# EAGLE design BT9803-150616-V2.0 (EAGLE 6.4)
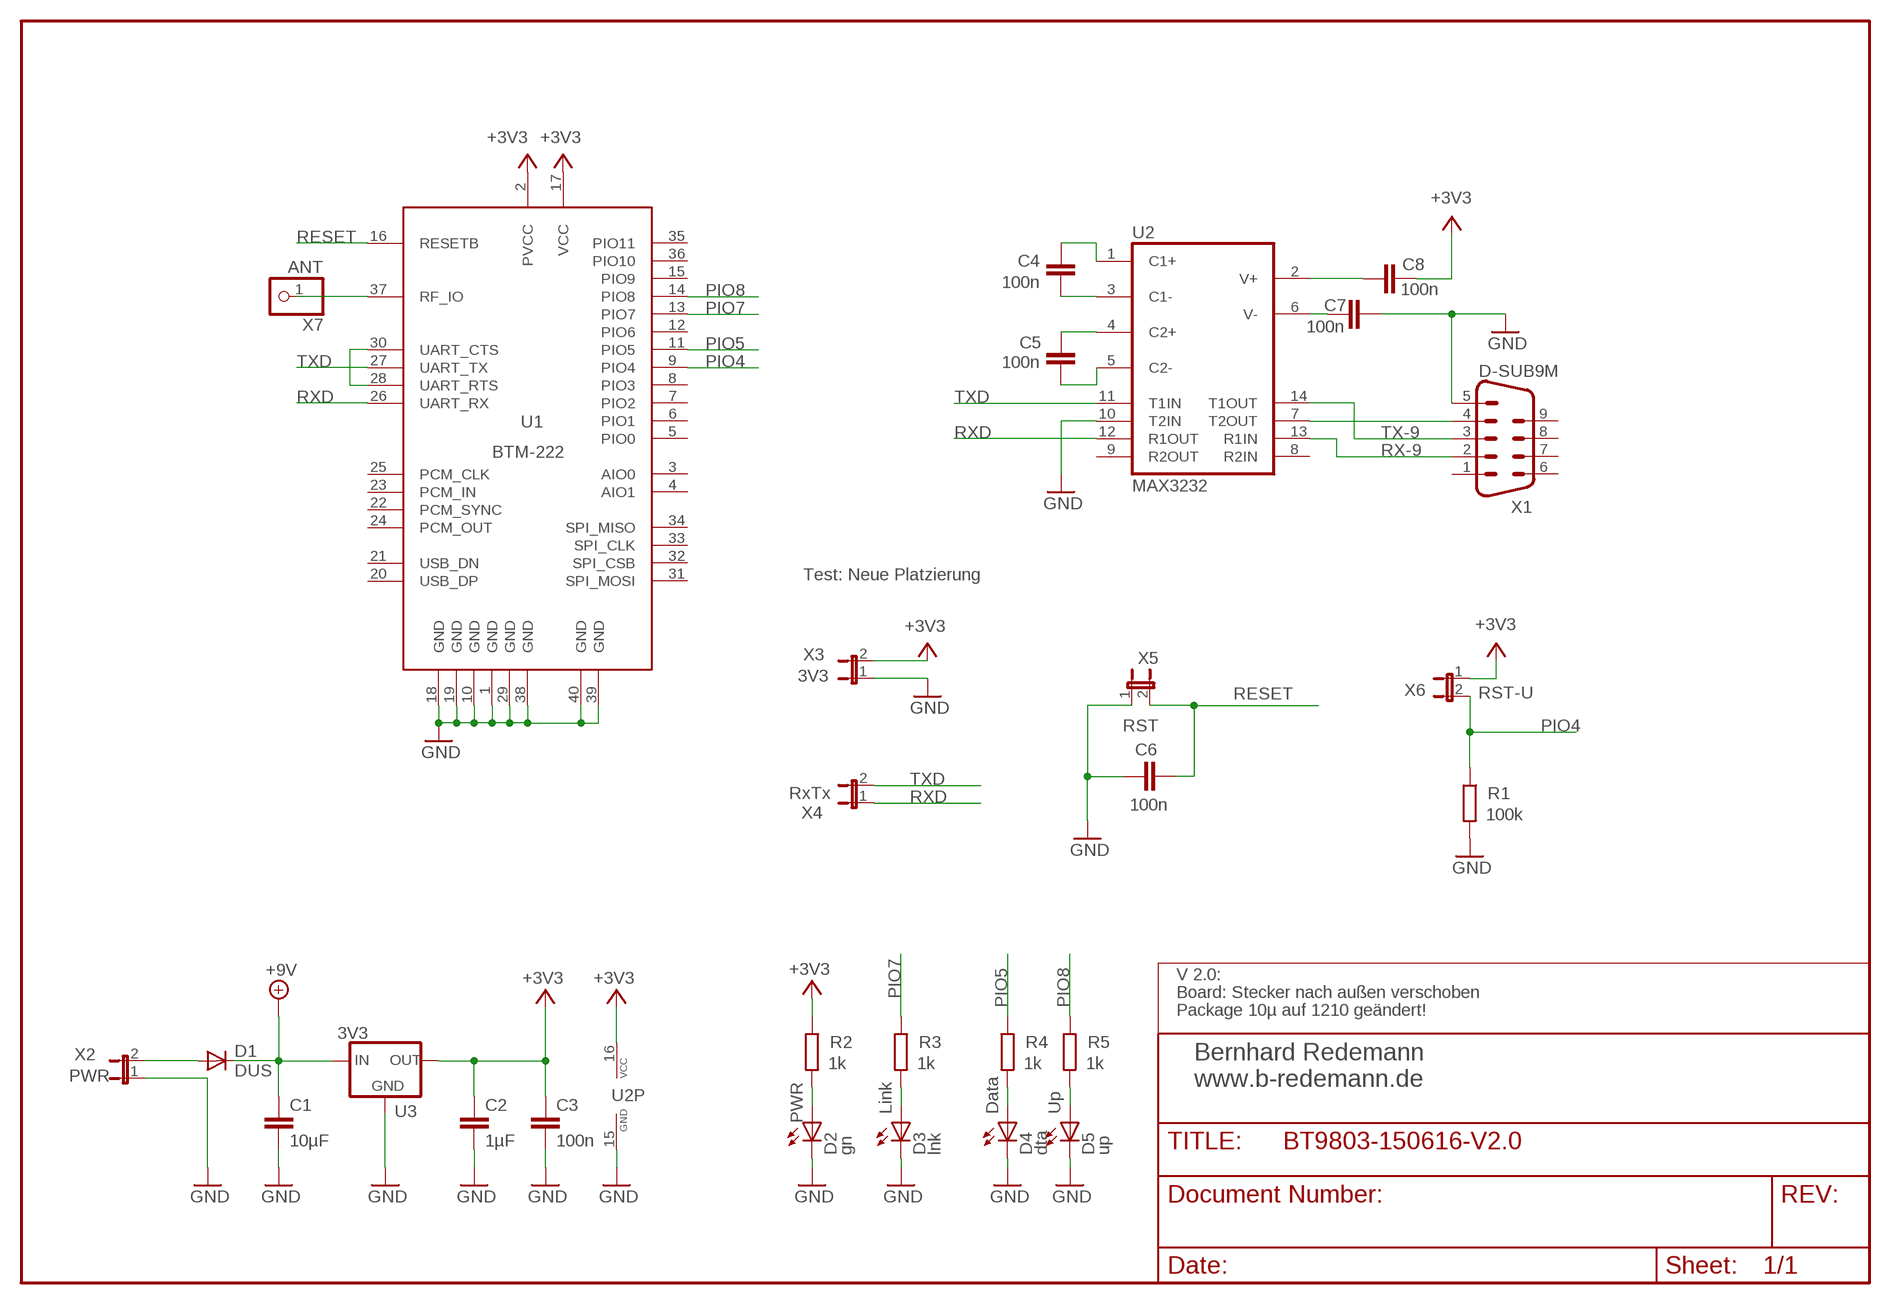
[diagram p0: schematic, sheet 1]

## Parts
C1  10µF  C-EUC1210  [C1210]
C2  1µF  C-EUC0805  [C0805]
C3  100n  C-EUC0805  [C0805]
C4  100n  C-EUC0805  [C0805]
C5  100n  C-EUC0805  [C0805]
C6  100n  C-EUC0805  [C0805]
C7  100n  C-EUC0805  [C0805]
C8  100n  C-EUC0805  [C0805]
D1  DUS  DIODE-DO-214AC  [DO-214AC]
D2  gn  LEDCHIP-LED0805  [CHIP-LED0805]
D3  lnk  LED3MM  [LED3MM]
D4  dta  LED3MM  [LED3MM]
D5  up  LED3MM  [LED3MM]
R1  100k  R-EU_R0805  [R0805]
R2  1k  R-EU_R0805  [R0805]
R3  1k  R-EU_R0805  [R0805]
R4  1k  R-EU_R0805  [R0805]
R5  1k  R-EU_R0805  [R0805]
U1  BTM-222  [38-PIN15]
U2  MAX3232  MAX232ECWETSSOP16  [TSSOP16]
U3  3V3  LM1117  [SOT223]
X1  D-SUB9M  M09D  [M09D]
X2  PWR  JP1E  [JP1]
X3  3V3  JP1E  [JP1]
X4  RxTx  JP1E  [JP1]
X5  RST  JP1E  [JP1]
X6  RST-U  JP1E  [JP1]
X7  ANT  PINHD-1X1  [1X01]

## Nets
+3V3: C2.1 C3.1 C8.1 R2.1 U1.2(PVCC) U1.17(VCC) U2.16(VCC) U3.2(OUT) X3.2 X6.1
+9V: C1.1 D1.C U3.3(IN)
DATA: D4.A R4.2
GND: C1.2 C2.2 C3.2 C6.1 C7.1 D2.C D3.K(C) D4.K(C) D5.K(C) R1.2 U1.1(GND) U1.10(GND) U1.18(GND) U1.19(GND) U1.29(GND) U1.38(GND) U1.39(GND) U1.40(GND) U2.10(T2IN) U2.15(GND) U3.1(GND) X1.5 X2.1 X3.1 X5.1
LINK: D3.A R3.2
N$1: U2.7(T2OUT) X1.4
N$2: U1.28(UART_RTS) U1.30(UART_CTS)
N$3: D1.A X2.2
N$351: C4.1 U2.3(C1-)
N$354: C5.2 U2.4(C2+)
N$355: C4.2 U2.1(C1+)
N$356: C5.1 U2.5(C2-)
N$357: C7.2 U2.6(V-)
N$358: C8.2 U2.2(V+)
PIO4: R1.1 U1.9(PIO4) X6.2
PIO5: R4.1 U1.11(PIO5)
PIO7: R3.1 U1.13(PIO7)
PIO8: R5.1 U1.14(PIO8)
PWR: D2.A R2.2
RESET: C6.2 U1.16(RESETB) X5.2
RF-222: U1.37(RF_IO) X7.1
RX-9: U2.13(R1IN) X1.2
RXD: U1.26(UART_RX) U2.12(R1OUT) X4.1
TX-9: U2.14(T1OUT) X1.3
TXD: U1.27(UART_TX) U2.11(T1IN) X4.2
UP: D5.A R5.2
Unconnected: U1.3(AIO0) U1.4(AIO1) U1.5(PIO0) U1.6(PIO1) U1.7(PIO2) U1.8(PIO3) U1.12(PIO6) U1.15(PIO9) U1.20(USB_DP) U1.21(USB_DN) U1.22(PCM_SYNC) U1.23(PCM_IN) U1.24(PCM_OUT) U1.25(PCM_CLK) U1.31(SPI_MOSI) U1.32(SPI_CSB) U1.33(SPI_CLK) U1.34(SPI_MISO) U1.35(PIO11) U1.36(PIO10) U2.8(R2IN) U2.9(R2OUT) X1.1 X1.6 X1.7 X1.8 X1.9

## Notes on the sheet
- Test: Neue Platzierung
- V 2.0:
- Board: Stecker nach außen verschoben
- Package 10µ auf 1210 geändert!
- Bernhard Redemann
  www.b-redemann.de
- Link | Data | Up
- PWR

## Library data of the parts
C1-C8 = rcl:C-EU: CAPACITOR, European symbol
D1 = diode:DIODE-: DIODE
D2-D5 = led:LED: LED OSRAM: - CHIPLED LG R971, LG N971, LY N971, LG Q971, LY Q971, LO R971, LY R971 LH N974, LH R974 LS Q976, LO Q976, LY Q976 LO Q996 - Hyper CHIPLED LW Q18S LB Q993, LB Q99A, LB R99A - SideLED LS A670, LO A670, LY A670, LG A670, LP A670 LB A673, LV A673, LT A673, LW A673 LH A674 LY A675 LS A676, LA A676, LO A676, LY A676, LW A676 LS A679, LY A679, LG A679 - Hyper Micro SIDELED® LS Y876, LA Y876, LO Y876, LY Y876 LT Y87S - SmartLED LW L88C, LW L88S LB L89C, LB L89S, LG L890 LS L89K, LO L89K, LY L89K LS L896, LA L896, LO L896, LY L896 - TOPLED LS T670, LO T670, LY T670, LG T670, LP T670 LSG T670, LSP T670, LSY T670, LOP T670, LYG T670 LG T671, LOG T671, LSG T671 LB T673, LV T673, LT T673, LW T673 LH T674 LS T676, LA T676, LO T676, LY T676, LB T676, LH T676, LSB T676, LW T676 LB T67C, LV T67C, LT T67C, LS T67K, LO T67K, LY T67K, LW E67C LS E67B, LA E67B, LO E67B, LY E67B, LB E67C, LV E67C, LT E67C LW T67C LS T679, LY T679, LG T679 LS T770, LO T770, LY T770, LG T770, LP T770 LB T773, LV T773, LT T773, LW T773 LH T774 LS E675, LA E675, LY E675, LS T675 LS T776, LA T776, LO T776, LY T776, LB T776 LHGB T686 LT T68C, LB T68C - Hyper Mini TOPLED® LB M676 - Mini TOPLED Santana® LG M470 LS M47K, LO M47K, LY M47K Source: http://www.osram.convergy.de LUXEON: - LUMILED® LXK2-PW12-R00, LXK2-PW12-S00, LXK2-PW14-U00, LXK2-PW14-V00 LXK2-PM12-R00, LXK2-PM12-S00, LXK2-PM14-U00 LXK2-PE12-Q00, LXK2-PE12-R00, LXK2-PE12-S00, LXK2-PE14-T00, LXK2-PE14-U00 LXK2-PB12-K00, LXK2-PB12-L00, LXK2-PB12-M00, LXK2-PB14-N00, LXK2-PB14-P00, LXK2-PB14-Q00 LXK2-PR12-L00, LXK2-PR12-M00, LXK2-PR14-Q00, LXK2-PR14-R00 LXK2-PD12-Q00, LXK2-PD12-R00, LXK2-PD12-S00 LXK2-PH12-R00, LXK2-PH12-S00 LXK2-PL12-P00, LXK2-PL12-Q00, LXK2-PL12-R00 Source: www.luxeon.com KINGBRIGHT: KA-3528ASYC Source: www.kingbright.com
R1-R5 = rcl:R-EU_: RESISTOR, European symbol
U1 = BRedemannSpecial:BTM-222
U2 = francotyp:MAX232ECWE: RS232 TRANSEIVER
U3 = v-reg-3:LM1117
X1 = con-subd:M09: SUB-D
X2-X6 = jumper:JP1E: JUMPER
X7 = pinhead:PINHD-1X1: PIN HEADER

## Board
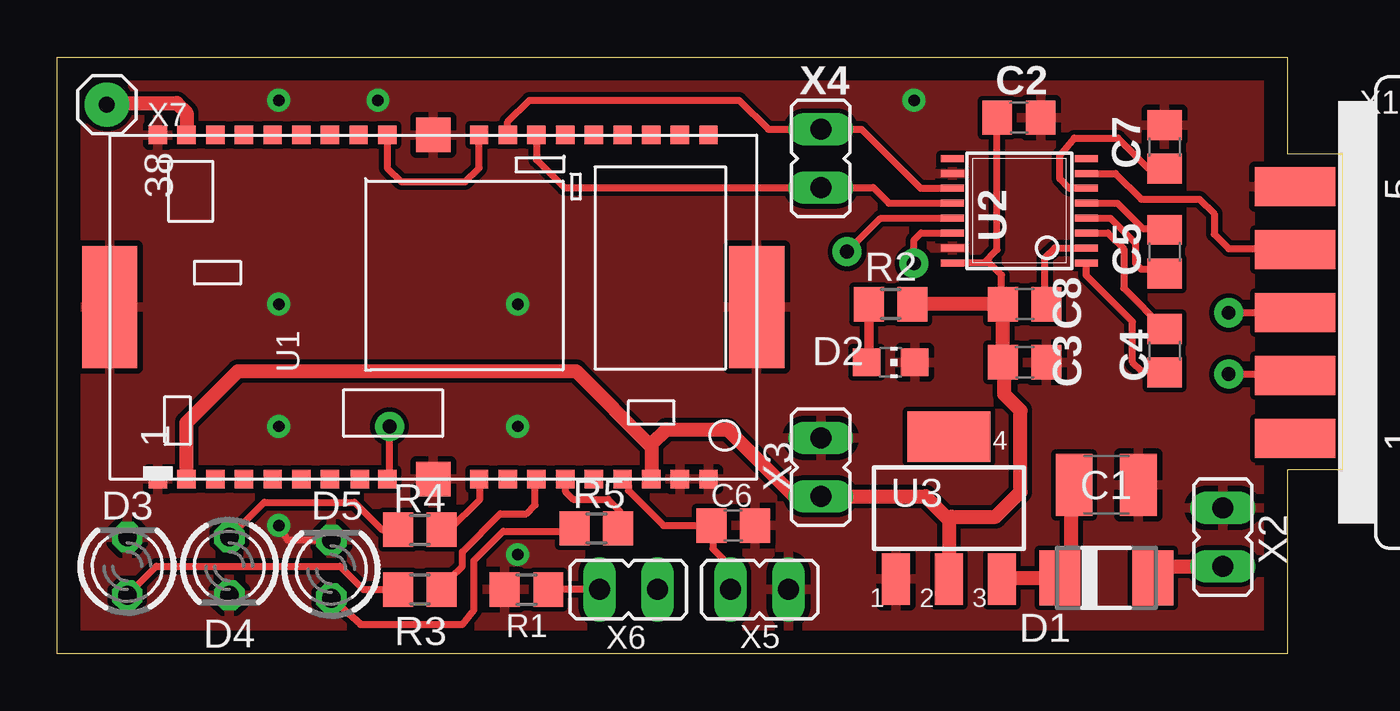
[diagram p1: board, top side]
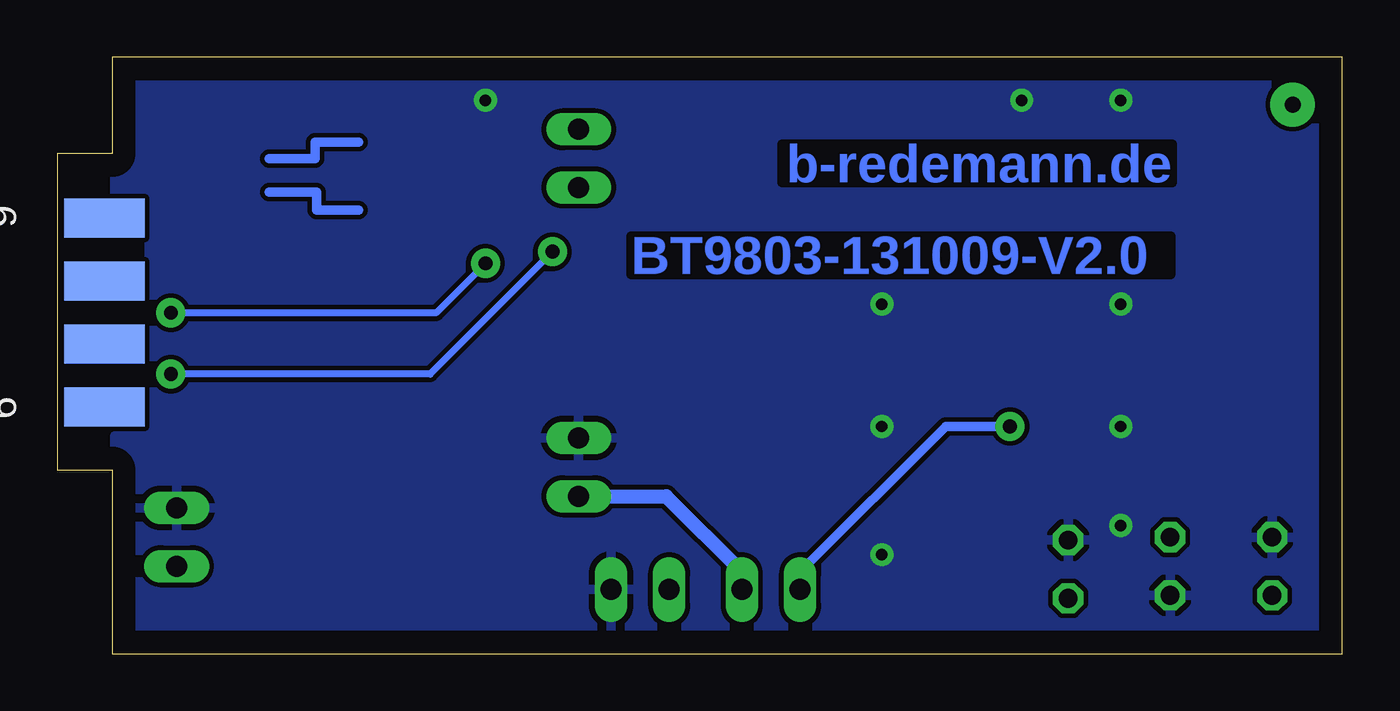
[diagram p2: board, bottom side, seen from below]

Size 56 x 26 mm. Coordinates in mm from the lower left corner, seen from the top.
Outline: 53.6,0 0,0 0,26 53.6,26 53.6,21.8 56,21.8 56,8 53.6,8 53.6,0
Copper layers (1+16): Top 0.035mm / dielectric 1.5mm / Bottom 0.035mm
Design rules "default *": minimum track width 10mil, minimum drill 0.5mm, track to track 8mil, track to pad 6mil, pad to pad 8mil, via to via 8mil, smd to smd 8mil, copper to edge 40mil, drill to drill 8mil, minimum pad ring 10mil, minimum via ring 8mil, stop-mask expansion 4mil, vias tented up to drill 0.61mm, thermal gap 10mil

### Footprints (pad centres in the part's own frame; a part is rotated, then mirrored left to right if it is on the bottom)
C1210 = smd 1.6 x 2.7: 1 -1.4,0; 2 1.4,0
C0805 = smd 1.3 x 1.5: 1 -0.95,0; 2 0.95,0
DO-214AC = smd 1.8 x 2.4: A 2.025,0; C -2.025,0
CHIP-LED0805 = smd 1.2 x 1.2: A 0,-1.05; C 0,1.05
LED3MM = drill 0.813 octagon: A -1.27,0; K 1.27,0
R0805 = smd 1.3 x 1.5: 1 -0.95,0; 2 0.95,0
38-PIN15 = smd 0.8 x 0.8: 1 -7.5,12; 2 -7.5,10.75; 3 -7.5,9.5; 4 -7.5,8.25; 5 -7.5,7; 6 -7.5,5.75; 7 -7.5,4.5; 8 -7.5,3.2; 9 -7.5,2; 11 -7.5,-2; 12 -7.5,-3.25; 13 -7.5,-4.5; 14 -7.5,-5.75; 15 -7.5,-7; 16 -7.5,-8.25; 17 -7.5,-9.5; 18 -7.5,-10.75; 19 -7.5,-12; 20 7.5,-12; 21 7.5,-10.75; 22 7.5,-9.5; 23 7.5,-8.25; 24 7.5,-7; 25 7.5,-5.75; 26 7.5,-4.5; 27 7.5,-3.25; 28 7.5,-2; 30 7.5,2; 31 7.5,3.25; 32 7.5,4.5; 33 7.5,5.75; 34 7.5,7; 35 7.5,8.25; 36 7.5,9.5; 37 7.5,10.75; 38 7.5,12 | smd 1.5 x 1.5: 10 -7.5,0; 29 7.5,0 | smd 5.3 x 2.4: 39 0,14.1; 40 0,-14.1
TSSOP16 = smd 0.305 x 0.991: 1 -2.275,-2.918; 2 -1.625,-2.918; 3 -0.975,-2.918; 4 -0.325,-2.918; 5 0.325,-2.918; 6 0.975,-2.918; 7 1.625,-2.918; 8 2.275,-2.918; 9 2.275,2.918; 10 1.625,2.918; 11 0.975,2.918; 12 0.325,2.918; 13 -0.325,2.918; 14 -0.975,2.918; 15 -1.625,2.918; 16 -2.275,2.918
SOT223 = smd 1.219 x 2.235: 1 -2.311,-3.099; 2 0,-3.099; 3 2.311,-3.099 | smd 3.6 x 2.2: 4 0,3.099
M09D = smd 1.7 x 3.5: 1 5.486,-6.045; 2 2.743,-6.045; 3 0,-6.045; 4 -2.743,-6.045; 5 -5.486,-6.045 | smd 1.7 x 3.5 bottom: 6 4.115,-6.045; 7 1.372,-6.045; 8 -1.372,-6.045; 9 -4.115,-6.045
JP1 = drill 0.914 long: 1 0,-1.27; 2 0,1.27
1X01 = drill 0.7 pad 1.93: 1 0,0

### Placement (x,y rotation side)
C1  45.72,7.37 0 top
C2  41.91,23.37 0 top
C3  42.16,12.7 0 top
C4  48.26,13.21 270 top
C5  48.26,17.53 270 top
C6  29.46,5.59 180 top
C7  48.26,22.1 270 top
C8  42.16,15.24 0 top
D1  45.72,3.3 0 top
D2  36.32,12.7 270 top
D3  3.05,3.81 90 top
D4  7.49,3.81 270 top
D5  11.94,3.68 90 top
R1  20.45,2.79 180 top
R2  36.32,15.24 180 top
R3  15.8,2.8 180 top
R4  15.8,5.4 180 top
R5  23.5,5.46 180 top
U1  16.38,15.11 90 top
U2  41.93,19.32 90 top
U3  38.86,6.35 0 top
X1  60,14.88 270 top
X2  50.8,5.08 180 top
X3  33.27,8.13 180 top
X4  33.27,21.59 0 top
X5  30.61,2.79 90 top
X6  24.89,2.79 90 top
X7  2.16,23.94 0 top

### Tracks (layer width: path | path; a pad name or v marks a point on that pad's centre or on a via)
+3V3
  Top 0.305: 40.39,17.04 40.62,17.04 41.15,16.51 41.15,15.31 C8.1 | 40.39,17.04 U2.16 | C2.1 40.96,17.61 40.39,17.04
  Top 0.406: 25.91,9.02 25.91,9.14 | 25.91,7.64 U1.17 | 41.27,12.7 C3.1 | 38.86,5.84 38.99,5.97
  Top 0.61: U3.2 38.86,5.84 37.85,6.86 X3.2 32.13,6.86 29.21,9.78 26.54,9.78 25.91,9.14 | 25.91,7.64 25.91,9.02 22.61,12.32 7.87,12.32 5.63,10.08 U1.2 | C3.1 C8.1 R2.1 | 41.27,12.7 41.27,11.3 41.98,10.6 41.98,7.05 40.89,5.97 38.99,5.97
  Bottom 0.61: X6.1 26.16,3.56 29.46,6.86 X3.2
+9V
  Top 0.61: C1.1 44.2,7.37 44.2,2.79 43.7,2.79 D1.C 41.17,3.3 U3.3
DATA
  Top 0.305: R4.2 14.16,5.4 12.95,6.6 9.02,6.6 D4.A
GND  (via drill 0.5 pad 1)
  Top 0.305: D5.K 10.03,4.95 v9.65,5.59
  other vias: 20.07,4.32 20.07,9.91 9.65,9.91 9.65,15.24 20.07,15.24 9.65,24.13 13.97,24.13 37.34,24.13
  pour Top: -1,28 53.5,28 53.5,19.5 52,19.5 52,17 52,8 53.5,8 53.5,-2 -1,-2
  pour Bottom: -1,28 53.5,28 53.5,20 52,20 52,9.5 53.5,9.5 53.5,-1 52,-1 -1,-1
LINK
  Top 0.305: R3.2 13.33,2.8 12.32,3.81 4.32,3.81 D3.A
N$1
  Top 0.305: U2.7 46.12,20.94 47.24,19.81 49.78,19.81 50.42,19.18 50.42,18.29 51.05,17.65 53.92,17.65 X1.4
N$2
  Top 0.305: U1.28 18.38,21.18 17.78,20.57 14.99,20.57 14.38,21.18 U1.30
N$3
  Top 0.61: X2.2 47.74,3.81 D1.A
N$300
  Bottom 0.406: 46.76,21.59 44.76,21.59 44.76,22.3 42.87,22.3
N$301
  Bottom 0.406: 46.76,20.12 44.7,20.12 44.7,19.35 42.86,19.35
N$351
  Top 0.305: U2.3 45.8,18.34 46.48,17.65 46.48,15.94 C4.1
N$354
  Top 0.305: U2.4 45.91,18.99 46.99,17.91 46.99,17.02 47.24,16.76 48.07,16.76 C5.2
N$355
  Top 0.305: U2.1 44.85,16.49 46.86,14.48 46.86,12.7 47.24,12.32 48.2,12.32 C4.2
N$356
  Top 0.305: U2.5 46.21,19.64 47.3,18.54 48.39,18.54 C5.1
N$357
  Top 0.305: C7.2 47.56,21.15 46.23,22.48 44.32,22.48 43.69,21.72 43.69,20.7 44.1,20.29 U2.6
N$358
  Top 0.305: U2.2 43.47,17.69 43.05,17.27 43.05,15.3 C8.2
PIO4  (via drill 0.6 pad 1.27)
  Top 0.305: X6.2 R1.1 | v14.48,9.91 14.48,7.71 U1.9
  Top 0.406: U1.9 14.35,7.64
  Bottom 0.406: X6.2 23.62,3.56 17.27,9.91 v14.48,9.91
PIO5
  Top 0.305: R4.1 17.08,5.4 18.41,6.73 18.41,7.58 U1.11
PIO7
  Top 0.305: R3.1 16.75,3.03 17.14,3.03 17.14,3.3 17.65,3.81 17.65,4.45 19.3,6.1 20.45,6.1 20.83,6.48 20.83,7.56 U1.13
PIO8
  Top 0.305: U1.14 22.13,7.08 22.48,6.73 24,6.73 24.51,6.22 24.51,5.53 R5.1
PWR
  Top 0.406: R2.2 35.37,12.8 D2.A
RESET
  Top 0.305: X5.2 29.28,3.88 28.57,4.57 28.57,5.59 C6.2 26.42,5.59 24.89,7.11 24.89,7.35 U1.16
RF-222
  Top 0.406: X7.1 2.22,24
  Top 0.61: U1.37 5.63,23.58 5.21,24 2.22,24
RX-9  (via drill 0.6 pad 1.27)
  Top 0.305: U2.13 35.88,18.99 v34.42,17.53 | v51.05,12.19 53.9,12.19 X1.2
  Bottom 0.305: v34.42,17.53 39.75,12.19 v51.05,12.19
RXD
  Top 0.305: U2.12 36.24,19.64 35.56,20.32 X4.1 22.1,20.32 20.88,21.54 U1.26
TX-9  (via drill 0.6 pad 1.27)
  Top 0.305: X1.3 51.07,14.88 v51.05,14.86 | U2.14 37.64,18.34 37.34,18.03 v37.34,17.02
  Bottom 0.305: v51.05,14.86 39.5,14.86 v37.34,17.02
TXD
  Top 0.305: U1.27 19.63,23.19 20.57,24.13 29.72,24.13 30.99,22.86 X4.2 35.05,22.86 37.62,20.29 U2.11
UP
  Top 0.305: D5.A 13.21,1.27 17.65,1.27 18.16,1.91 18.16,4.06 19.43,5.33 22.42,5.33 R5.2

### Text on the board
Bottom: b-redemann.de | BT9803-131009-V2.0
tValues: b-redemann.de | Tx | Rx | GND | BT9803 | GND | + | 3V3 | V+ | + | +